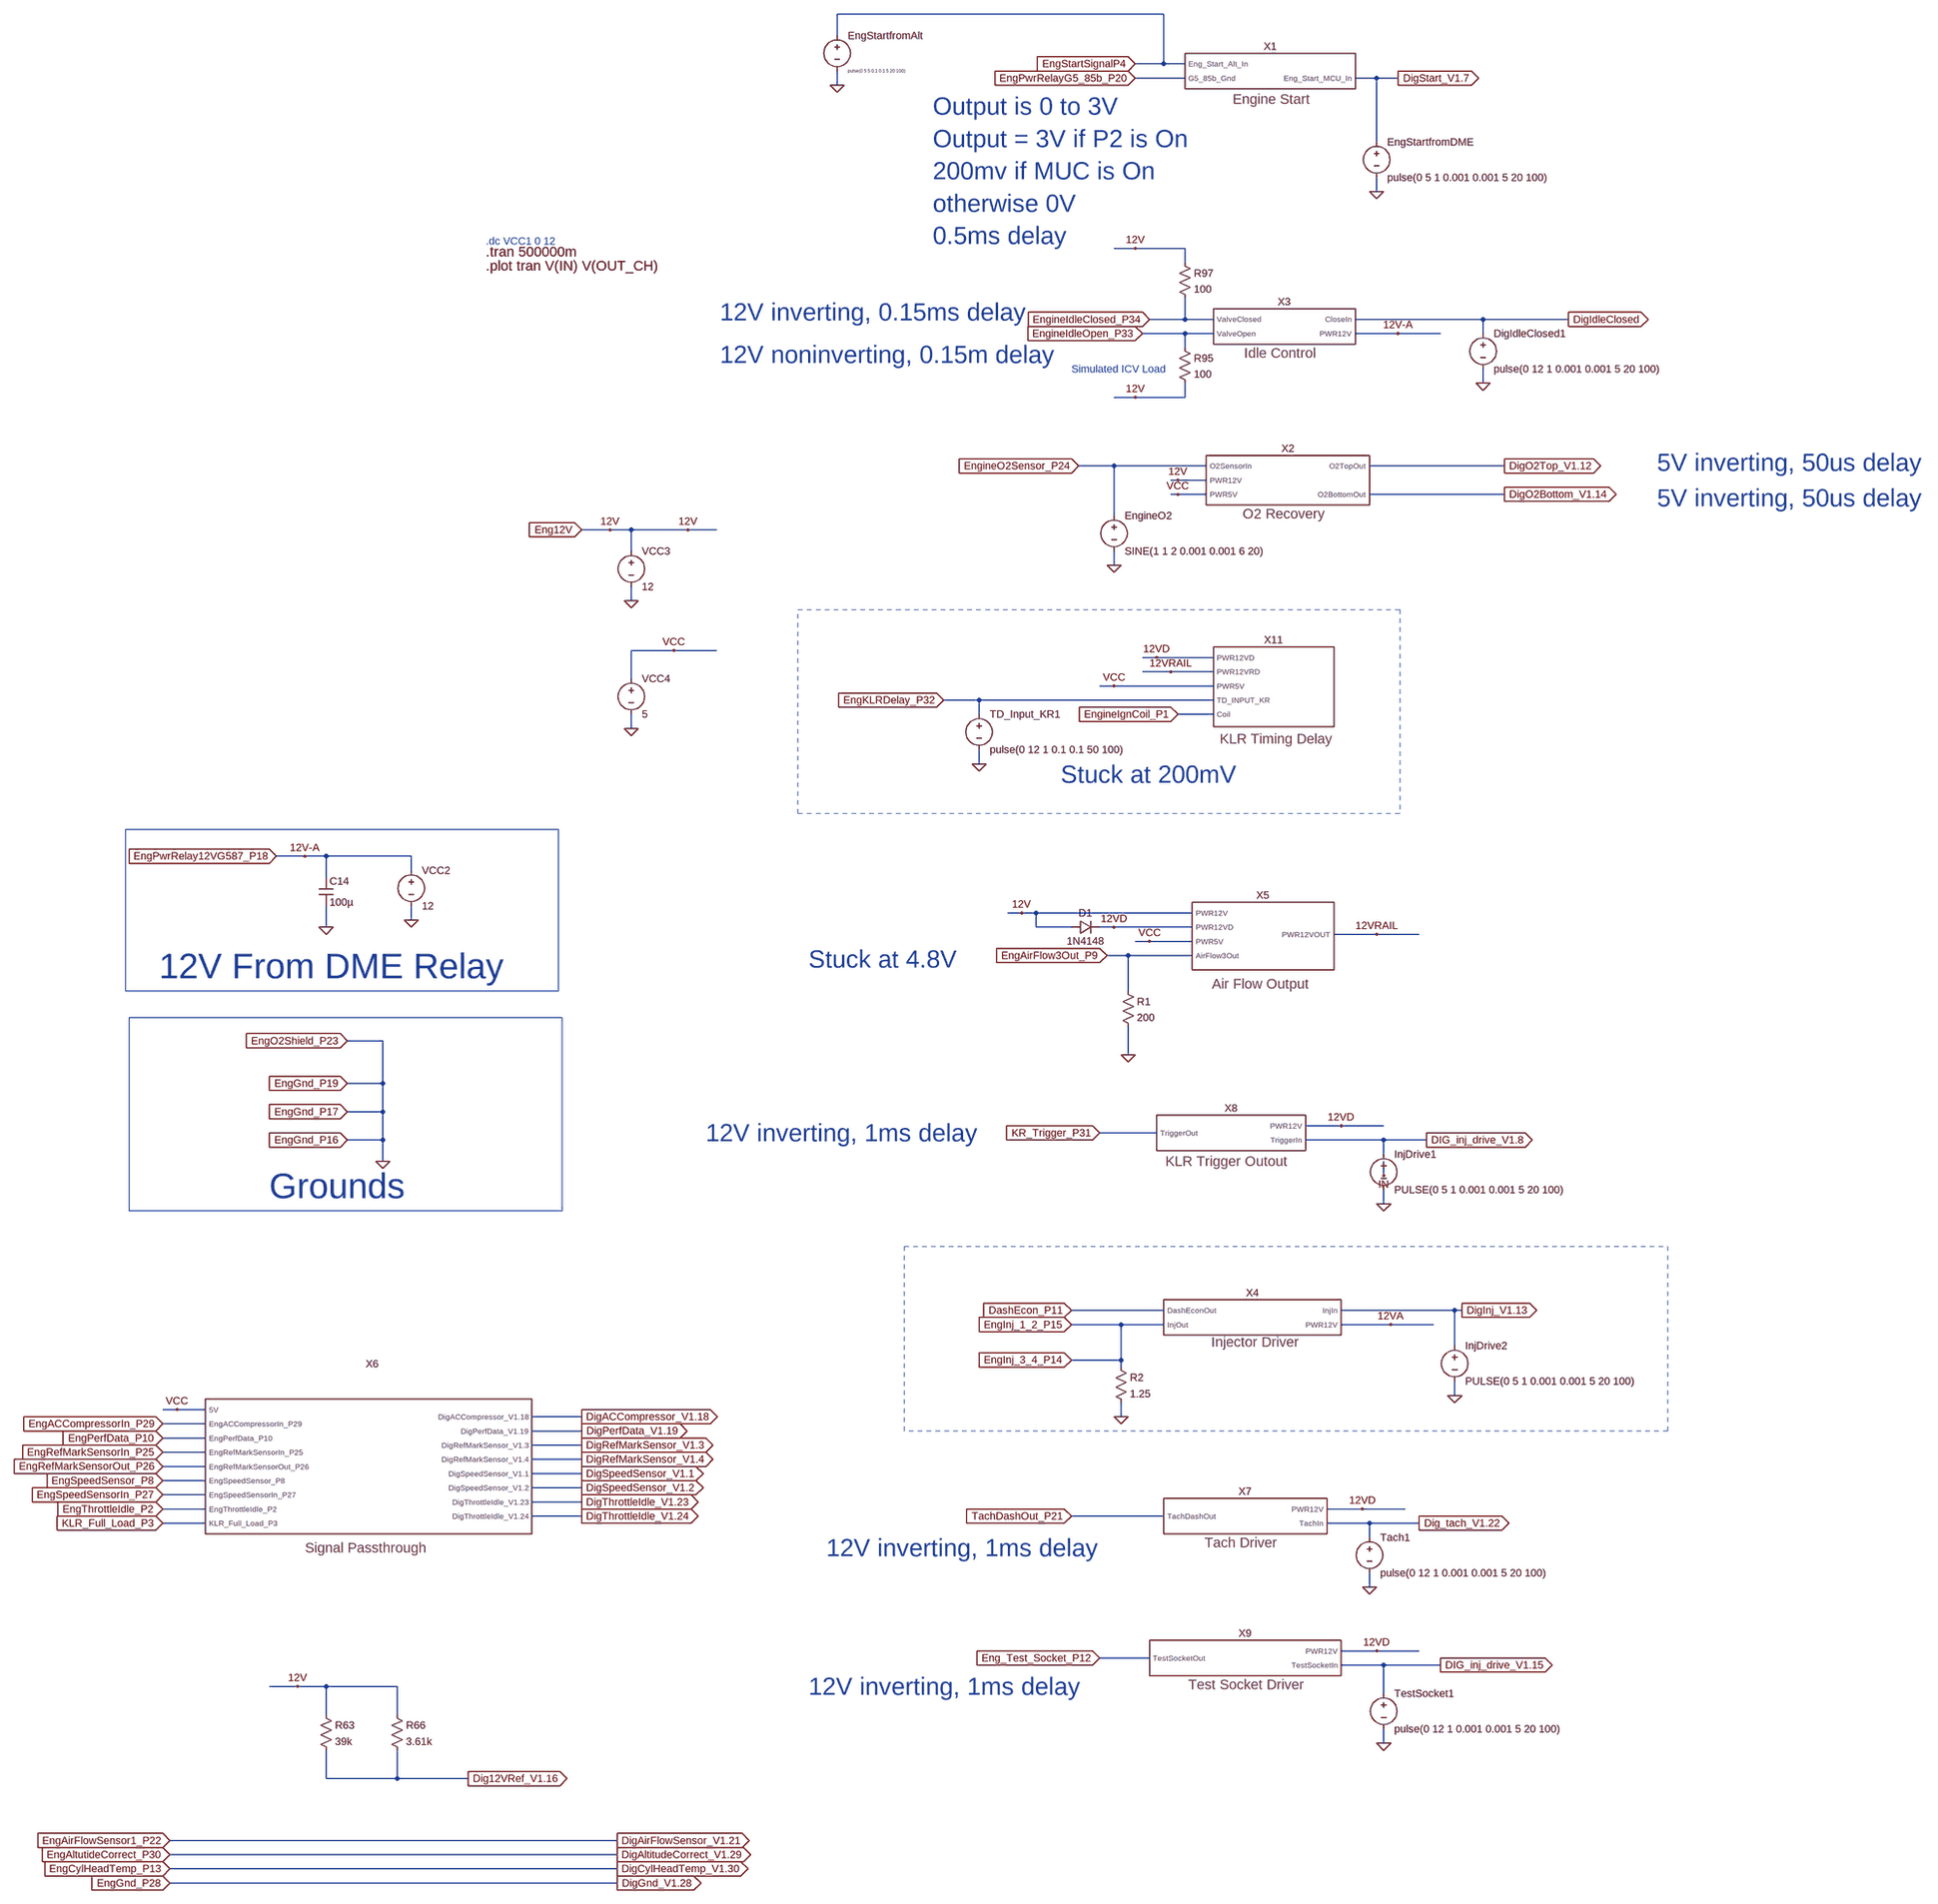
[diagram p0: schematic dme_analog_full_hierchical.asc]
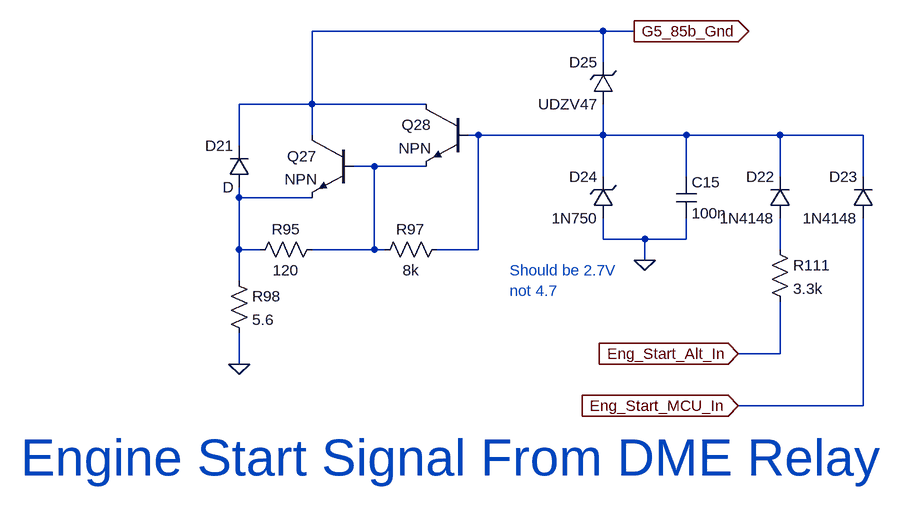
[diagram p1: sub-circuit engine_start.asc]
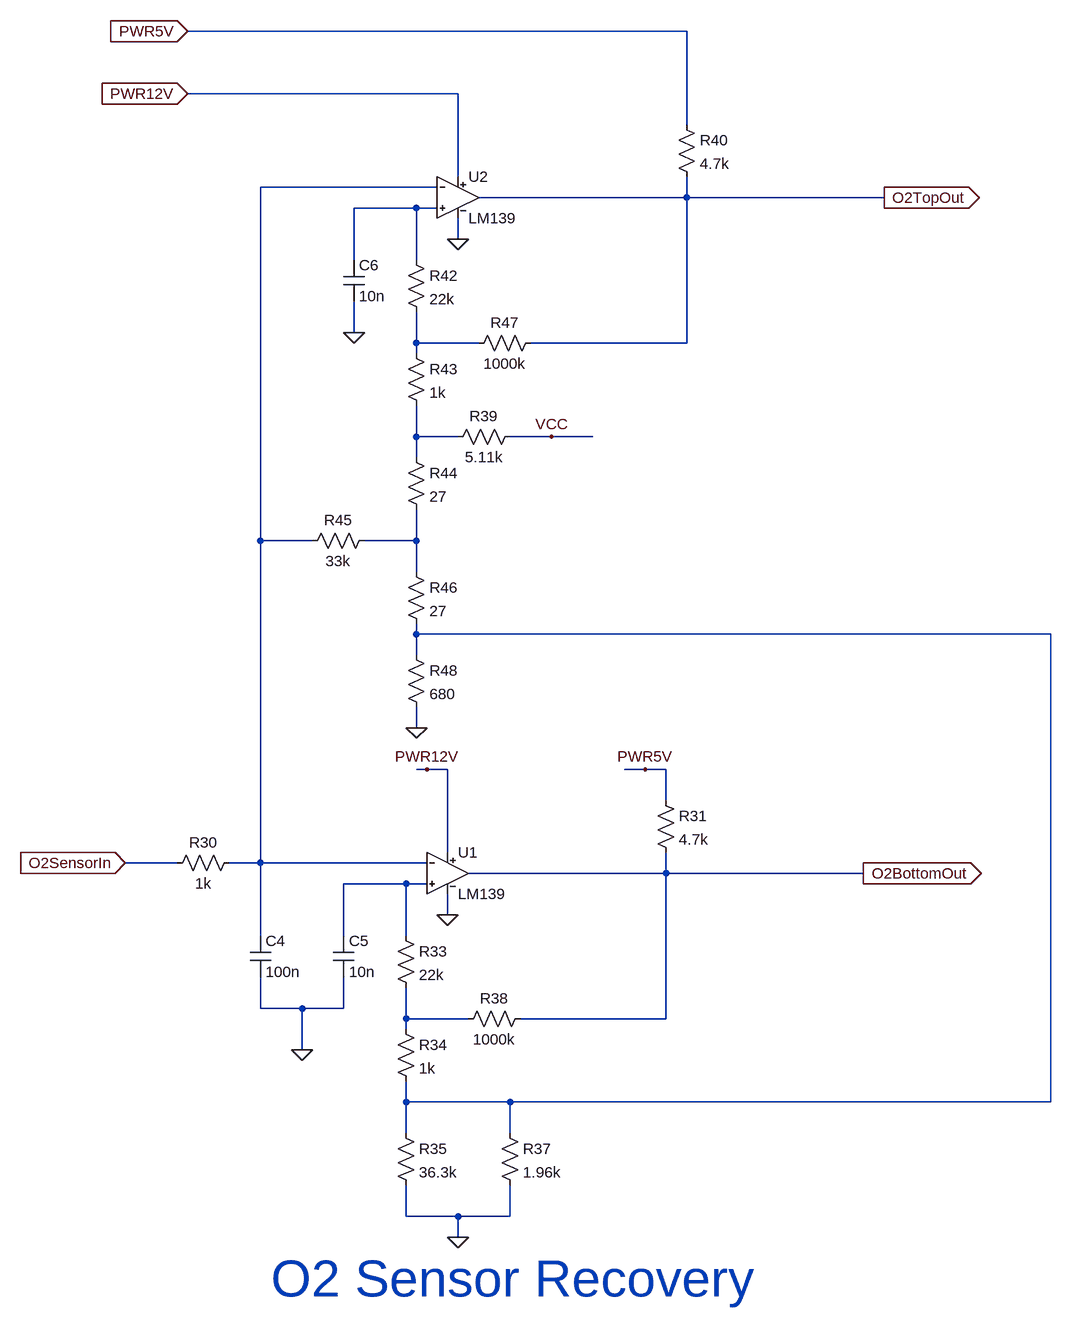
[diagram p2: sub-circuit dme_analog_o2_recovery.asc]
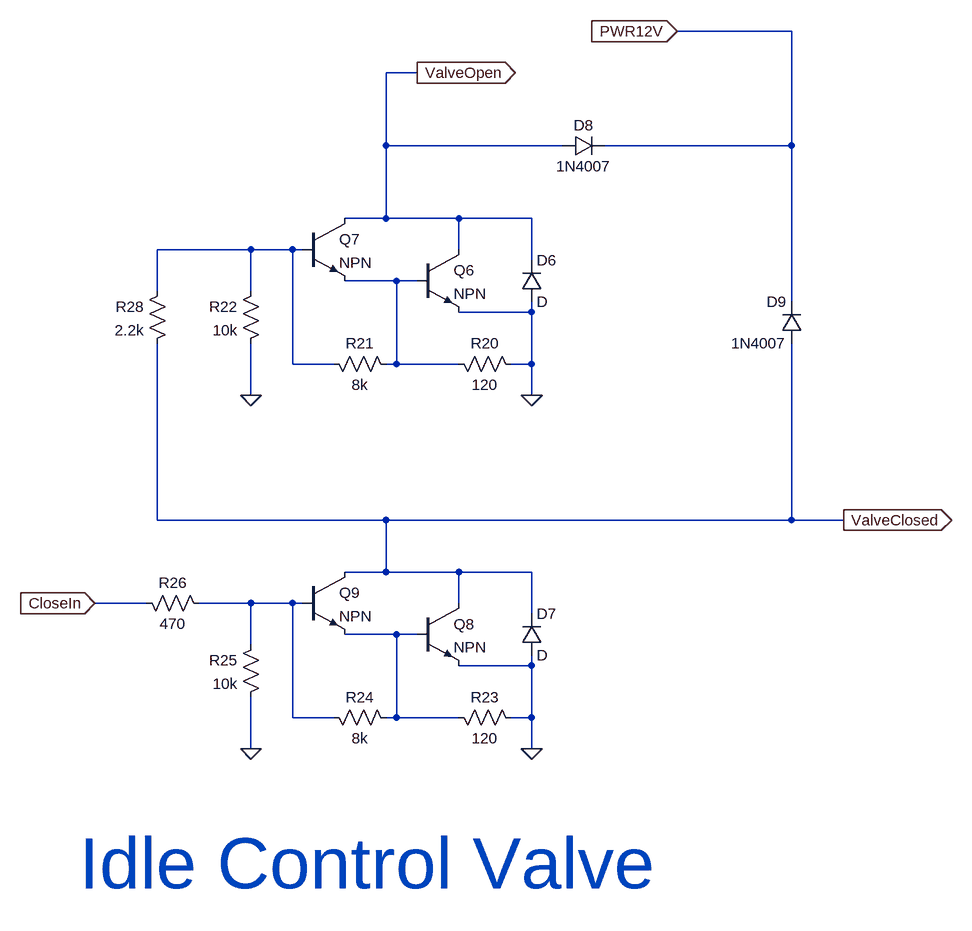
[diagram p3: sub-circuit dme_analog_idle_control.asc]
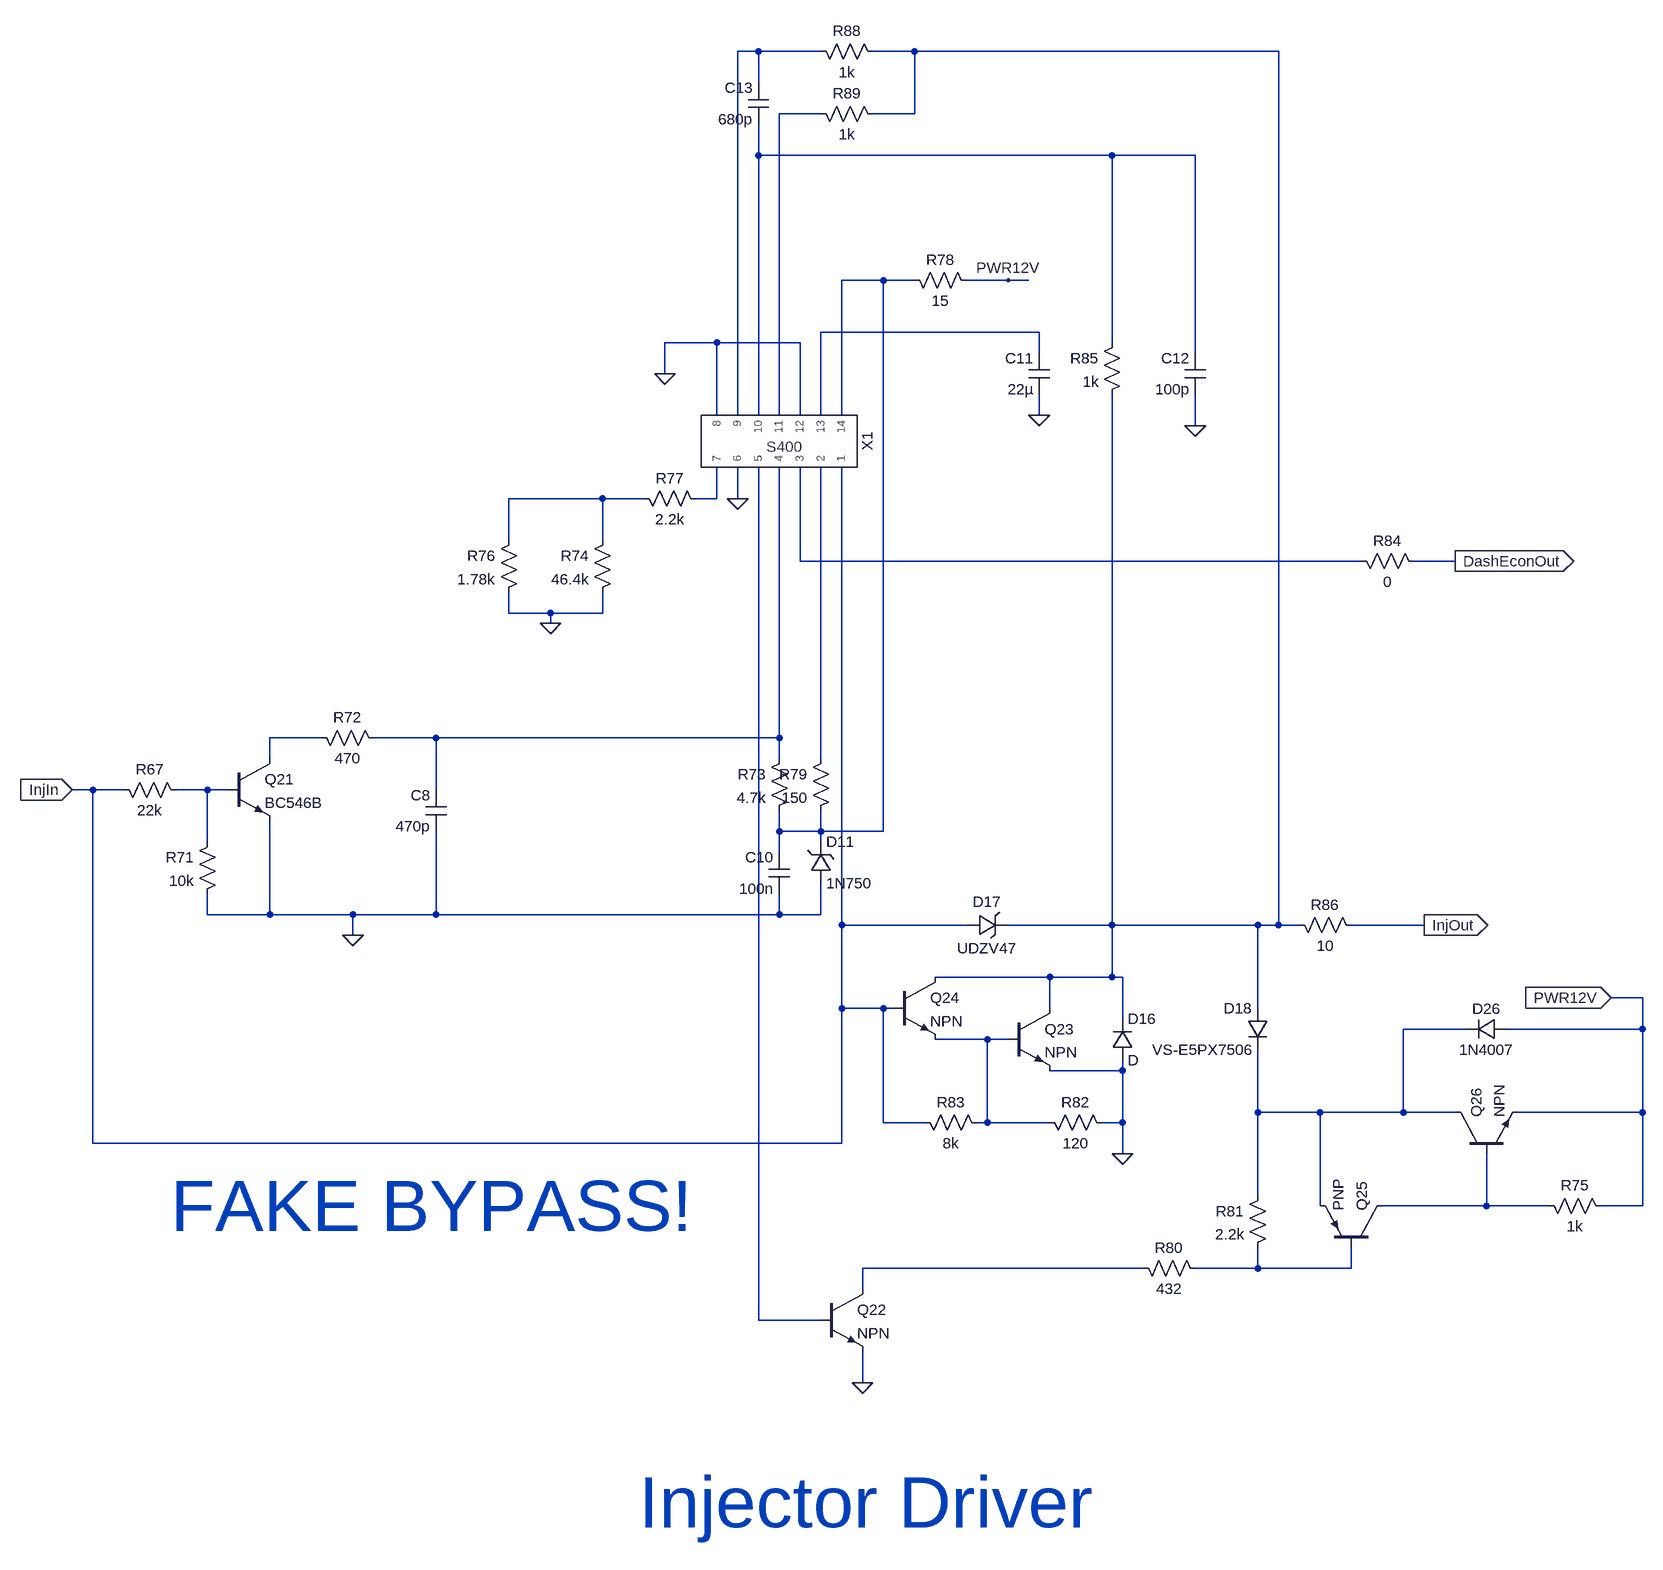
[diagram p4: sub-circuit dme_analog_injector_driver.asc]
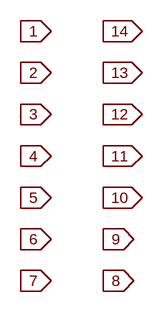
[diagram p5: sub-circuit s400.asc]
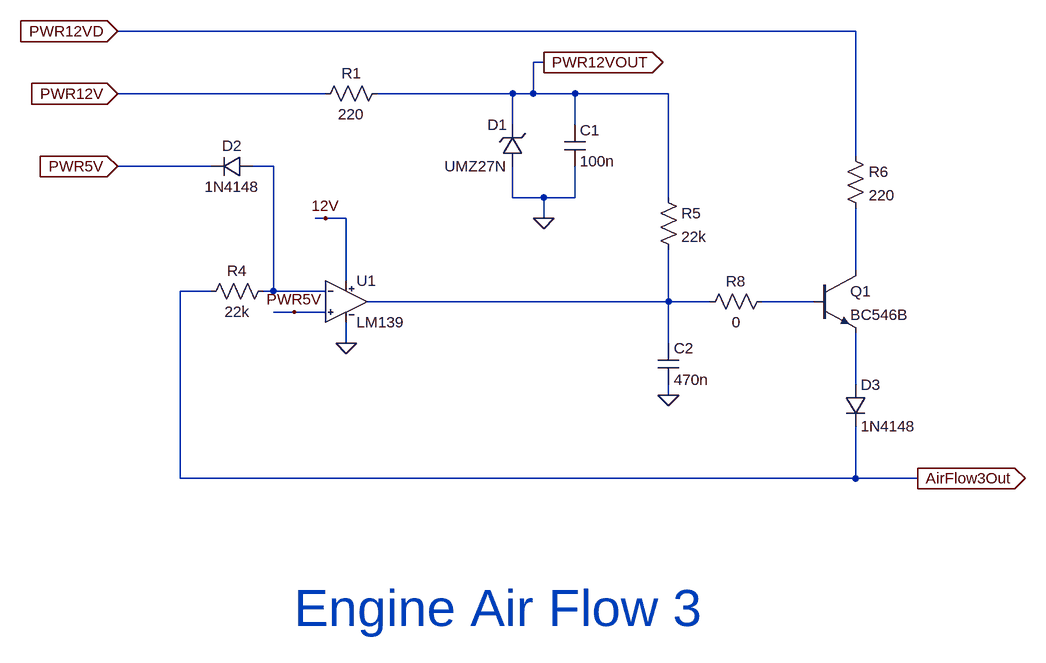
[diagram p6: sub-circuit dme_analog_airflow.asc]
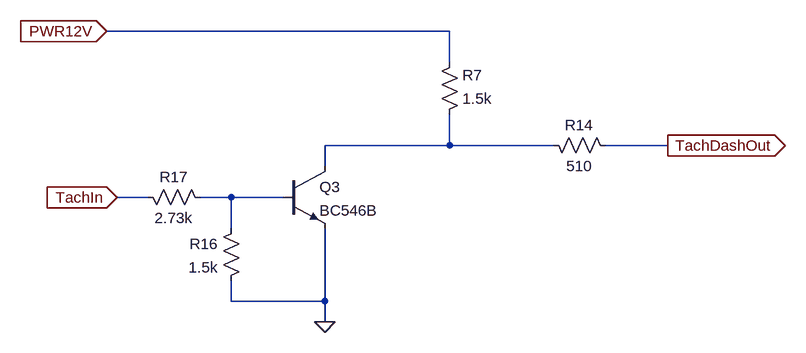
[diagram p7: sub-circuit dme_analog_tach.asc]
dme_analog_full_hierchical.asc, the LTspice schematic file:
Version 4
SHEET 1 4356 7768
WIRE -4000 -4064 -4736 -4064
WIRE -4736 -4016 -4736 -4064
WIRE -4000 -3952 -4000 -4064
WIRE -4000 -3952 -4064 -3952
WIRE -3952 -3952 -4000 -3952
WIRE -3952 -3920 -4064 -3920
WIRE -3520 -3920 -3568 -3920
WIRE -3472 -3920 -3520 -3920
WIRE -4736 -3904 -4736 -3936
WIRE -3520 -3776 -3520 -3920
WIRE -3520 -3664 -3520 -3696
WIRE -4064 -3536 -4112 -3536
WIRE -3952 -3536 -4064 -3536
WIRE -3952 -3504 -3952 -3536
WIRE -3952 -3376 -3952 -3424
WIRE -3952 -3376 -4032 -3376
WIRE -3888 -3376 -3952 -3376
WIRE -3280 -3376 -3568 -3376
WIRE -3088 -3376 -3280 -3376
WIRE -3952 -3344 -4048 -3344
WIRE -3888 -3344 -3952 -3344
WIRE -3472 -3344 -3568 -3344
WIRE -3376 -3344 -3472 -3344
WIRE -3280 -3344 -3280 -3376
WIRE -3952 -3312 -3952 -3344
WIRE -3280 -3232 -3280 -3264
WIRE -4064 -3200 -4112 -3200
WIRE -3952 -3200 -3952 -3232
WIRE -3952 -3200 -4064 -3200
WIRE -4112 -2992 -4192 -2992
WIRE -3904 -2992 -4112 -2992
WIRE -3232 -2992 -3536 -2992
WIRE -3968 -2960 -3984 -2960
WIRE -3904 -2960 -3968 -2960
WIRE -3968 -2928 -3984 -2928
WIRE -3904 -2928 -3968 -2928
WIRE -3232 -2928 -3536 -2928
WIRE -4112 -2880 -4112 -2992
WIRE -5248 -2848 -5312 -2848
WIRE -5200 -2848 -5248 -2848
WIRE -5072 -2848 -5200 -2848
WIRE -5008 -2848 -5072 -2848
WIRE -5200 -2800 -5200 -2848
WIRE -4112 -2768 -4112 -2800
WIRE -5200 -2688 -5200 -2720
WIRE -5104 -2576 -5200 -2576
WIRE -5008 -2576 -5104 -2576
WIRE -4016 -2560 -4048 -2560
WIRE -3888 -2560 -4016 -2560
WIRE -3984 -2528 -4048 -2528
WIRE -3888 -2528 -3984 -2528
WIRE -5200 -2512 -5200 -2576
WIRE -4112 -2496 -4144 -2496
WIRE -3888 -2496 -4112 -2496
WIRE -4416 -2464 -4496 -2464
WIRE -3888 -2464 -4416 -2464
WIRE -4416 -2432 -4416 -2464
WIRE -3888 -2432 -3968 -2432
WIRE -5200 -2400 -5200 -2432
WIRE -4416 -2320 -4416 -2352
WIRE -5936 -2112 -6000 -2112
WIRE -5888 -2112 -5936 -2112
WIRE -5696 -2112 -5888 -2112
WIRE -5696 -2080 -5696 -2112
WIRE -5888 -2064 -5888 -2112
WIRE -4320 -1984 -4352 -1984
WIRE -4288 -1984 -4320 -1984
WIRE -3936 -1984 -4288 -1984
WIRE -5696 -1968 -5696 -2000
WIRE -5888 -1952 -5888 -2000
WIRE -4288 -1952 -4288 -1984
WIRE -4208 -1952 -4288 -1952
WIRE -4112 -1952 -4144 -1952
WIRE -3936 -1952 -4112 -1952
WIRE -3520 -1936 -3616 -1936
WIRE -3424 -1936 -3520 -1936
WIRE -4032 -1920 -4064 -1920
WIRE -3936 -1920 -4032 -1920
WIRE -4080 -1888 -4128 -1888
WIRE -3936 -1888 -4080 -1888
WIRE -4080 -1808 -4080 -1888
WIRE -5760 -1696 -5840 -1696
WIRE -4080 -1664 -4080 -1728
WIRE -5760 -1600 -5760 -1696
WIRE -5760 -1600 -5840 -1600
WIRE -5760 -1536 -5760 -1600
WIRE -5760 -1536 -5840 -1536
WIRE -3600 -1504 -3680 -1504
WIRE -3504 -1504 -3600 -1504
WIRE -4016 -1488 -4144 -1488
WIRE -5760 -1472 -5760 -1536
WIRE -5760 -1472 -5840 -1472
WIRE -3504 -1472 -3680 -1472
WIRE -3408 -1472 -3504 -1472
WIRE -3504 -1440 -3504 -1472
WIRE -5760 -1424 -5760 -1472
WIRE -3504 -1392 -3504 -1424
WIRE -3504 -1328 -3504 -1360
WIRE -4000 -1088 -4208 -1088
WIRE -3344 -1088 -3600 -1088
WIRE -3328 -1088 -3344 -1088
WIRE -4096 -1056 -4208 -1056
WIRE -4000 -1056 -4096 -1056
WIRE -3488 -1056 -3600 -1056
WIRE -3392 -1056 -3488 -1056
WIRE -3344 -1008 -3344 -1088
WIRE -4096 -976 -4096 -1056
WIRE -4096 -976 -4208 -976
WIRE -4096 -960 -4096 -976
WIRE -3344 -896 -3344 -928
WIRE -6224 -864 -6256 -864
WIRE -6160 -864 -6224 -864
WIRE -5312 -848 -5424 -848
WIRE -4096 -848 -4096 -880
WIRE -6160 -832 -6256 -832
WIRE -5312 -816 -5424 -816
WIRE -6160 -800 -6256 -800
WIRE -5312 -784 -5424 -784
WIRE -6160 -768 -6256 -768
WIRE -5312 -752 -5424 -752
WIRE -6160 -736 -6256 -736
WIRE -5312 -720 -5424 -720
WIRE -6160 -704 -6256 -704
WIRE -5312 -688 -5424 -688
WIRE -6160 -672 -6256 -672
WIRE -5312 -656 -5424 -656
WIRE -6160 -640 -6256 -640
WIRE -3552 -640 -3632 -640
WIRE -3456 -640 -3552 -640
WIRE -5312 -624 -5424 -624
WIRE -4000 -624 -4208 -624
WIRE -6160 -608 -6256 -608
WIRE -3536 -608 -3632 -608
WIRE -3424 -608 -3536 -608
WIRE -3536 -576 -3536 -608
WIRE -3536 -464 -3536 -496
WIRE -3520 -320 -3600 -320
WIRE -3424 -320 -3520 -320
WIRE -4032 -304 -4144 -304
WIRE -3504 -288 -3600 -288
WIRE -3376 -288 -3504 -288
WIRE -5952 -240 -6016 -240
WIRE -5888 -240 -5952 -240
WIRE -5728 -240 -5888 -240
WIRE -3504 -224 -3504 -288
WIRE -5888 -176 -5888 -240
WIRE -5728 -176 -5728 -240
WIRE -3504 -112 -3504 -144
WIRE -5888 -32 -5888 -96
WIRE -5728 -32 -5728 -96
WIRE -5728 -32 -5888 -32
WIRE -5568 -32 -5728 -32
WIRE -5232 144 -6240 144
WIRE -5232 176 -6240 176
WIRE -5232 208 -6240 208
WIRE -5232 240 -6240 240
FLAG -5952 -240 12V
FLAG -5568 -32 Dig12VRef_V1.16
IOPIN -5568 -32 Out
FLAG -5840 -1472 EngGnd_P16
IOPIN -5840 -1472 In
FLAG -5840 -1536 EngGnd_P17
IOPIN -5840 -1536 In
FLAG -5840 -1600 EngGnd_P19
IOPIN -5840 -1600 In
FLAG -5840 -1696 EngO2Shield_P23
IOPIN -5840 -1696 In
FLAG -5760 -1424 0
FLAG -6000 -2112 EngPwrRelay12VG587_P18
IOPIN -6000 -2112 In
FLAG -5936 -2112 12V-A
FLAG -5888 -1952 0
FLAG -5312 -2848 Eng12V
IOPIN -5312 -2848 In
FLAG -5248 -2848 12V
FLAG -5696 -1968 0
FLAG -3472 -3920 DigStart_V1.7
IOPIN -3472 -3920 Out
FLAG -4064 -3920 EngPwrRelayG5_85b_P20
IOPIN -4064 -3920 In
FLAG -4064 -3952 EngStartSignalP4
IOPIN -4064 -3952 In
FLAG -4048 -3344 EngineIdleOpen_P33
IOPIN -4048 -3344 In
FLAG -4064 -3200 12V
FLAG -4032 -3376 EngineIdleClosed_P34
IOPIN -4032 -3376 In
FLAG -4064 -3536 12V
FLAG -3088 -3376 DigIdleClosed
IOPIN -3088 -3376 Out
FLAG -3280 -3232 0
FLAG -3472 -3344 12V-A
FLAG -4192 -2992 EngineO2Sensor_P24
IOPIN -4192 -2992 In
FLAG -3968 -2960 12V
FLAG -3968 -2928 VCC
FLAG -3232 -2992 DigO2Top_V1.12
IOPIN -3232 -2992 Out
FLAG -3232 -2928 DigO2Bottom_V1.14
IOPIN -3232 -2928 Out
FLAG -4112 -2768 0
FLAG -5200 -2688 0
FLAG -5200 -2400 0
FLAG -4112 -2496 VCC
FLAG -3968 -2432 EngineIgnCoil_P1
IOPIN -3968 -2432 In
FLAG -4416 -2320 0
FLAG -4496 -2464 EngKLRDelay_P32
IOPIN -4496 -2464 In
FLAG -3984 -2528 12VRAIL
FLAG -4016 -2560 12VD
FLAG -5072 -2848 12V
FLAG -5104 -2576 VCC
FLAG -4032 -1920 VCC
FLAG -4320 -1984 12V
FLAG -4128 -1888 EngAirFlow3Out_P9
IOPIN -4128 -1888 In
FLAG -4080 -1664 0
FLAG -3520 -1936 12VRAIL
FLAG -4112 -1952 12VD
FLAG -4144 -1488 KR_Trigger_P31
IOPIN -4144 -1488 In
FLAG -3424 -608 Dig_tach_V1.22
IOPIN -3424 -608 Out
FLAG -3536 -464 0
FLAG -3408 -1472 DIG_inj_drive_V1.8
IOPIN -3408 -1472 Out
FLAG -3504 -1328 0
FLAG -3504 -1392 IN
FLAG -3600 -1504 12VD
FLAG -3552 -640 12VD
FLAG -4208 -624 TachDashOut_P21
IOPIN -4208 -624 In
FLAG -3488 -1056 12VA
FLAG -3328 -1088 DigInj_V1.13
IOPIN -3328 -1088 Out
FLAG -4208 -1088 DashEcon_P11
IOPIN -4208 -1088 In
FLAG -4208 -1056 EngInj_1_2_P15
IOPIN -4208 -1056 In
FLAG -4208 -976 EngInj_3_4_P14
IOPIN -4208 -976 In
FLAG -3376 -288 DIG_inj_drive_V1.15
IOPIN -3376 -288 Out
FLAG -3504 -112 0
FLAG -4144 -304 Eng_Test_Socket_P12
IOPIN -4144 -304 In
FLAG -3520 -320 12VD
FLAG -5312 -784 DigRefMarkSensor_V1.3
IOPIN -5312 -784 Out
FLAG -5312 -752 DigRefMarkSensor_V1.4
IOPIN -5312 -752 Out
FLAG -5312 -848 DigACCompressor_V1.18
IOPIN -5312 -848 Out
FLAG -5312 -688 DigSpeedSensor_V1.2
IOPIN -5312 -688 Out
FLAG -5312 -816 DigPerfData_V1.19
IOPIN -5312 -816 Out
FLAG -5312 -720 DigSpeedSensor_V1.1
IOPIN -5312 -720 Out
FLAG -5312 -624 DigThrottleIdle_V1.24
IOPIN -5312 -624 Out
FLAG -5312 -656 DigThrottleIdle_V1.23
IOPIN -5312 -656 Out
FLAG -6256 -768 EngRefMarkSensorIn_P25
IOPIN -6256 -768 In
FLAG -6256 -736 EngRefMarkSensorOut_P26
IOPIN -6256 -736 In
FLAG -6256 -832 EngACCompressorIn_P29
IOPIN -6256 -832 In
FLAG -6256 -704 EngSpeedSensor_P8
IOPIN -6256 -704 In
FLAG -6256 -800 EngPerfData_P10
IOPIN -6256 -800 In
FLAG -6256 -672 EngSpeedSensorIn_P27
IOPIN -6256 -672 In
FLAG -6256 -608 KLR_Full_Load_P3
IOPIN -6256 -608 In
FLAG -6256 -640 EngThrottleIdle_P2
IOPIN -6256 -640 In
FLAG -5232 176 DigAltitudeCorrect_V1.29
IOPIN -5232 176 Out
FLAG -5232 144 DigAirFlowSensor_V1.21
IOPIN -5232 144 Out
FLAG -5232 240 DigGnd_V1.28
IOPIN -5232 240 Out
FLAG -5232 208 DigCylHeadTemp_V1.30
IOPIN -5232 208 Out
FLAG -6240 144 EngAirFlowSensor1_P22
IOPIN -6240 144 In
FLAG -6240 240 EngGnd_P28
IOPIN -6240 240 In
FLAG -6240 176 EngAltutideCorrect_P30
IOPIN -6240 176 In
FLAG -6240 208 EngCylHeadTemp_P13
IOPIN -6240 208 In
FLAG -6224 -864 VCC
FLAG -3520 -3664 0
FLAG -4736 -3904 0
FLAG -3344 -896 0
FLAG -4096 -848 0
SYMBOL Res -5904 -192 R0
SYMATTR InstName R63
SYMATTR Value 39k
SYMBOL Res -5744 -192 R0
SYMATTR InstName R66
SYMATTR Value 3.61k
SYMBOL Cap -5904 -2064 R0
SYMATTR InstName C14
SYMATTR Value 100µ
SYMBOL voltage -5696 -2096 R0
SYMATTR InstName VCC2
SYMATTR Value 12
SYMBOL engine_start -3760 -3936 R0
SYMATTR InstName X1
SYMBOL dme_analog_O2_recovery -3728 -2960 R0
SYMATTR InstName X2
SYMBOL dme_analog_idle_control -3728 -3360 M0
SYMATTR InstName X3
SYMBOL dme_analog_injector_driver -3792 -1072 M0
SYMATTR InstName X4
SYMBOL dme_analog_airflow -3776 -1952 R0
SYMATTR InstName X5
SYMBOL dme_analog_tach -3808 -624 M0
SYMATTR InstName X7
SYMBOL dme_analog_KLR_Trigger -3840 -1488 M0
SYMATTR InstName X8
SYMBOL dme_analog_test_socket -3808 -304 M0
SYMATTR InstName X9
SYMBOL Res -3968 -3328 R0
SYMATTR InstName R95
SYMATTR Value 100
SYMBOL Res -3968 -3520 R0
SYMATTR InstName R97
SYMATTR Value 100
SYMBOL voltage -3280 -3360 R0
SYMATTR Value pulse(0 12 1 0.001 0.001 5 20 100)
SYMATTR InstName DigIdleClosed1
SYMBOL voltage -4112 -2896 R0
SYMATTR Value SINE(1 1 2 0.001 0.001 6 20)
SYMATTR InstName EngineO2
SYMBOL dme_analog_timing_delay -3760 -2512 R0
SYMATTR InstName X11
SYMBOL voltage -5200 -2816 R0
SYMATTR InstName VCC3
SYMATTR Value 12
SYMBOL voltage -5200 -2528 R0
SYMATTR InstName VCC4
SYMATTR Value 5
SYMBOL voltage -4416 -2448 R0
SYMATTR Value pulse(0 12 1 0.1 0.1 50 100)
SYMATTR InstName TD_Input_KR1
SYMBOL Res -4096 -1824 R0
SYMATTR InstName R1
SYMATTR Value 200
SYMBOL diode -4208 -1968 M90
WINDOW 0 0 32 VBottom 2
WINDOW 3 32 32 VTop 2
SYMATTR InstName D1
SYMATTR Value 1N4148
SYMBOL voltage -3536 -592 R0
SYMATTR Value pulse(0 12 1 0.001 0.001 5 20 100)
SYMATTR InstName Tach1
SYMBOL voltage -3504 -1456 R0
SYMATTR Value PULSE(0 5 1 0.001 0.001 5 20 100)
SYMATTR InstName InjDrive1
SYMBOL voltage -3504 -240 R0
SYMATTR Value pulse(0 12 1 0.001 0.001 5 20 100)
SYMATTR InstName TestSocket1
SYMBOL dme_analog_passthrough -5792 -736 R0
WINDOW 0 8 -216 Bottom 2
SYMATTR InstName X6
SYMBOL voltage -3520 -3792 R0
SYMATTR Value pulse(0 5 1 0.001 0.001 5 20 100)
SYMATTR InstName EngStartfromDME
SYMBOL voltage -4736 -4032 R0
WINDOW 3 24 96 Left 0
SYMATTR Value pulse(0 5 5 0.1 0.1 5 20 100)
SYMATTR InstName EngStartfromAlt
SYMBOL voltage -3344 -1024 R0
SYMATTR Value PULSE(0 5 1 0.001 0.001 5 20 100)
SYMATTR InstName InjDrive2
SYMBOL Res -4112 -976 R0
SYMATTR InstName R2
SYMATTR Value 1.25
TEXT -6264 -1864 Left 6 ;12V From DME Relay
TEXT -6016 -1368 Left 6 ;Grounds
TEXT -4208 -3264 Left 2 ;Simulated ICV Load
TEXT -2888 -3000 Left 5 ;5V inverting, 50us delay
TEXT -4520 -3856 Left 5 ;Output is 0 to 3V\nOutput = 3V if P2 is On\n200mv if MUC is On\notherwise 0V\n0.5ms delay
TEXT -5000 -3392 Left 5 ;12V inverting, 0.15ms delay
TEXT -4800 -1880 Left 5 ;Stuck at 4.8V
TEXT -5032 -1488 Left 5 ;12V inverting, 1ms delay
TEXT -4800 -240 Left 5 ;12V inverting, 1ms delay
TEXT -4760 -552 Left 5 ;12V inverting, 1ms delay
TEXT -4232 -2296 Left 5 ;Stuck at 200mV
TEXT -5528 -3528 Left 3 !.tran 500000m
TEXT -5528 -3496 Left 3 !.plot tran V(IN) V(OUT_CH)
TEXT -5528 -3552 Left 2 ;.dc VCC1 0 12
TEXT -2888 -2920 Left 5 ;5V inverting, 50us delay
TEXT -5000 -3296 Left 5 ;12V noninverting, 0.15m delay
RECTANGLE Normal -6340 -2172 -5364 -1808
RECTANGLE Normal -6332 -1748 -5356 -1312
RECTANGLE Normal -4584 -1232 -2864 -816 2
RECTANGLE Normal -4824 -2668 -3468 -2208 2

The netlist it stands for:
* dme_analog_full_hierchical.asc
R63 Eng12V Dig12VRef_V1.16 39k
R66 Eng12V Dig12VRef_V1.16 3.61k
C14 12V-A 0 100µ
VCC2 12V-A 0 12
XX1 EngStartSignalP4 DigStart_V1.7 EngPwrRelayG5_85b_P20 engine_start
XX2 EngineO2Sensor_P24 Eng12V VCC DigO2Bottom_V1.14 DigO2Top_V1.12 dme_analog_o2_recovery
XX3 DigIdleClosed 12V-A EngineIdleClosed_P34 EngineIdleOpen_P33 dme_analog_idle_control
XX4 DigInj_V1.13 12VA DashEcon_P11 EngInj_3_4_P14 dme_analog_injector_driver
XX5 Eng12V 12VD VCC EngAirFlow3Out_P9 12VRAIL dme_analog_airflow
XX7 12VD Dig_tach_V1.22 TachDashOut_P21 dme_analog_tach
XX8 12VD DIG_inj_drive_V1.8 KR_Trigger_P31 dme_analog_klr_trigger
XX9 12VD DIG_inj_drive_V1.15 Eng_Test_Socket_P12 dme_analog_test_socket
R95 EngineIdleOpen_P33 Eng12V 100
R97 Eng12V EngineIdleClosed_P34 100
V§DigIdleClosed1 DigIdleClosed 0 pulse(0 12 1 0.001 0.001 5 20 100)
V§EngineO2 EngineO2Sensor_P24 0 SINE(1 1 2 0.001 0.001 6 20)
XX11 12VD 12VRAIL VCC EngKLRDelay_P32 EngineIgnCoil_P1 dme_analog_timing_delay
VCC3 Eng12V 0 12
VCC4 VCC 0 5
V§TD_Input_KR1 EngKLRDelay_P32 0 pulse(0 12 1 0.1 0.1 50 100)
R1 EngAirFlow3Out_P9 0 200
D1 Eng12V 12VD 1N4148
V§Tach1 Dig_tach_V1.22 0 pulse(0 12 1 0.001 0.001 5 20 100)
V§InjDrive1 DIG_inj_drive_V1.8 0 PULSE(0 5 1 0.001 0.001 5 20 100)
V§TestSocket1 DIG_inj_drive_V1.15 0 pulse(0 12 1 0.001 0.001 5 20 100)
XX6 VCC EngACCompressorIn_P29 EngPerfData_P10 EngRefMarkSensorIn_P25 EngRefMarkSensorOut_P26 EngSpeedSensor_P8 EngSpeedSensorIn_P27 EngThrottleIdle_P2 KLR_Full_Load_P3 DigACCompressor_V1.18 DigPerfData_V1.19 DigRefMarkSensor_V1.3 DigRefMarkSensor_V1.4 DigSpeedSensor_V1.1 DigSpeedSensor_V1.2 DigThrottleIdle_V1.23 DigThrottleIdle_V1.24 dme_analog_passthrough
V§EngStartfromDME DigStart_V1.7 0 pulse(0 5 1 0.001 0.001 5 20 100)
V§EngStartfromAlt EngStartSignalP4 0 pulse(0 5 5 0.1 0.1 5 20 100)
V§InjDrive2 DigInj_V1.13 0 PULSE(0 5 1 0.001 0.001 5 20 100)
R2 EngInj_3_4_P14 0 1.25

* block symbol definitions
.subckt engine_start Eng_Start_Alt_In Eng_Start_MCU_In G5_85b_Gnd
Q27 G5_85b_Gnd N002 N003 0 NPN
Q28 G5_85b_Gnd N001 N002 0 NPN
D21 N003 G5_85b_Gnd D
R95 N002 N003 120
R97 N002 N001 8k
R98 N003 0 5.6
D22 N004 N001 1N4148
D23 Eng_Start_MCU_In N001 1N4148
R111 N004 Eng_Start_Alt_In 3.3k
C15 N001 0 100n
D24 0 N001 1N750
D25 N001 G5_85b_Gnd UDZV47
* Engine Start Signal From DME Relay
* Should be 2.7V
* not 4.7
.ends engine_start

.subckt dme_analog_o2_recovery O2SensorIn PWR12V PWR5V O2BottomOut O2TopOut
R30 N001 O2SensorIn 1k
R31 PWR5V O2BottomOut 4.7k
C4 N001 0 100n
C5 N007 0 10n
R33 N007 N008 22k
R34 N008 N006 1k
R35 N006 0 36.3k
R37 N006 0 1.96k
R38 O2BottomOut N008 1000k
R40 PWR5V O2TopOut 4.7k
C6 N002 0 10n
R42 N002 N003 22k
R43 N003 N004 1k
R44 N004 N005 27
R47 O2TopOut N003 1000k
R39 VCC N004 5.11k
R45 N005 N001 33k
R46 N005 N006 27
R48 N006 0 680
XU1 N007 N001 PWR12V 0 O2BottomOut LM139  ; pins In+ In- V+ V- OUT
XU2 N002 N001 PWR12V 0 O2TopOut LM139  ; pins In+ In- V+ V- OUT
* O2 Sensor Recovery
.ends dme_analog_o2_recovery

.subckt dme_analog_idle_control CloseIn PWR12V ValveClosed ValveOpen
Q6 ValveOpen N002 0 0 NPN
Q7 ValveOpen N001 N002 0 NPN
D6 0 ValveOpen D
R20 N002 0 120
R21 N002 N001 8k
R22 N001 0 10k
Q8 ValveClosed N004 0 0 NPN
Q9 ValveClosed N003 N004 0 NPN
D7 0 ValveClosed D
R23 N004 0 120
R24 N004 N003 8k
R25 N003 0 10k
R26 CloseIn N003 470
D8 ValveOpen PWR12V 1N4007
R28 N001 ValveClosed 2.2k
D9 ValveClosed PWR12V 1N4007
* Idle Control Valve
.ends dme_analog_idle_control

.subckt dme_analog_injector_driver InjIn PWR12V DashEconOut InjOut
R67 InjIn N013 22k
R71 N013 0 10k
R72 N010 N011 470
C8 N011 0 470p
Q21 N010 N013 0 0 BC546B
R73 N011 N005 4.7k
C10 N005 0 100n
R74 N007 0 46.4k
R76 N007 0 1.78k
R77 N007 N008 2.2k
R79 N012 N005 150
D11 0 N005 1N750
R78 N005 PWR12V 15
Q22 N017 N019 0 0 NPN
R80 N017 N018 432
R81 N014 N018 2.2k
Q23 N002 N015 0 0 NPN
Q24 N002 InjIn N015 0 NPN
D16 0 N002 D
R82 N015 0 120
R83 N015 InjIn 8k
R84 N009 DashEconOut 0
C11 N006 0 22µ
R85 N004 N002 1k
D17 InjIn N002 UDZV47
R86 N002 InjOut 10
C12 N004 0 100p
Q25 N016 N018 N014 0 PNP
Q26 N014 N016 PWR12V 0 NPN
D18 N002 N014 VS-E5PX7506
R89 N003 N002 1k
R88 N001 N002 1k
C13 N001 N004 680p
D26 PWR12V N014 1N4007
R75 N016 PWR12V 1k
XX1 InjIn N012 N009 N011 N019 0 N008 N005 N006 0 N003 N004 N001 0 s400
* Injector Driver
* FAKE BYPASS!
.ends dme_analog_injector_driver

.subckt s400 1 2 3 4 5 6 7 14 13 12 11 10 9 8
.ends s400

.subckt dme_analog_airflow PWR12V PWR12VD PWR5V AirFlow3Out PWR12VOUT
R4 N001 AirFlow3Out 22k
D2 N001 PWR5V 1N4148
R5 PWR12VOUT N003 22k
C2 N003 0 470n
D3 N005 AirFlow3Out 1N4148
Q1 N002 N004 N005 0 BC546B
R6 PWR12VD N002 220
R8 N004 N003 0
D1 0 PWR12VOUT UMZ27N
C1 PWR12VOUT 0 100n
R1 PWR12VOUT PWR12V 220
XU1 PWR5V N001 12V 0 N003 LM139  ; pins In+ In- V+ V- OUT
* Engine Air Flow 3
.ends dme_analog_airflow

.subckt dme_analog_tach PWR12V TachIn TachDashOut
R7 N001 PWR12V 1.5k
Q3 N001 N002 0 0 BC546B
R16 N002 0 1.5k
R17 TachIn N002 2.73k
R14 N001 TachDashOut 510
.ends dme_analog_tach

.subckt dme_analog_klr_trigger PWR12V TriggerIn TriggerOut
Q2 N001 N002 N003 0 BC546B
R9 PWR12V N001 1.5k
R10 N003 0 0
R11 N002 0 3.3k
R13 TriggerIn N002 220
R12 N001 TriggerOut 510
* KL_Trigger_Drive
.ends dme_analog_klr_trigger

.subckt dme_analog_test_socket PWR12V TestSocketIn TestSocketOut
Q18 N001 N002 0 0 BC546B
R60 PWR12V N001 1.5k
R68 N002 0 2.2k
R69 TestSocketIn N002 2.2k
R70 N001 TestSocketOut 510
* Test Socket
.ends dme_analog_test_socket

.subckt dme_analog_timing_delay PWR12VD PWR12VRD PWR5V TD_INPUT_KR Coil
R501 PWR12VRD TD_INPUT_KR 10k
R502 N004 N008 1k
C501 N008 TD_INPUT_KR 470n
D501 N004 PWR12VRD 1N4148
R513 N003 PWR12VRD 22k
R512 N003 N006 220k
R511 N006 0 13.1k
D502 OUT_CH N003 1N4148
R506 PWR5V OUT_CH 1k
R1 PWR12VRD N006 100k
R2 PWR12VRD N004 330k
Q10 OUT_CH N002 N007 0 NPN
Q11 N005 N001 N007 0 NPN
R32 N007 0 287
R36 PWR5V N002 5.62k
R41 PWR5V N001 5.62k
R49 PWR5V N005 1k
R50 N001 0 3.83k
R51 N001 0 121k
R52 N001 0 14.7k
Q12 Coil N013 N014 0 NPN
Q13 Coil N012 N013 0 NPN
D10 N014 Coil D
R53 N013 N014 120
R54 N013 N012 8k
R55 N013 0 1
R56 N013 0 18
R57 N012 N013 100
R59 N013 N002 2.2k
R58 N012 N011 15
C3 N013 0 10n
D12 0 Coil 1N4007
C7 Coil 0 10n
R61 N009 Coil 1.8k
R62 N009 0 5.62k
R64 N009 0 8.25k
C9 N009 Coil 330p
D13 N010 N009 1N4148
D14 N012 N010 1N4148
Q14 N011 N015 PWR12VD 0 PNP
Q15 N015 OUT_CH N011 0 BC546B
R65 N015 PWR12VD 150
XU1 N006 N004 PWR12VRD 0 N003 LM139  ; pins In+ In- V+ V- OUT
* TIMING DELAY FROM KLR
.ends dme_analog_timing_delay

.subckt dme_analog_passthrough 5V EngACCompressorIn_P29 EngPerfData_P10 EngRefMarkSensorIn_P25 EngRefMarkSensorOut_P26 EngSpeedSensor_P8 EngSpeedSensorIn_P27 EngThrottleIdle_P2 KLR_Full_Load_P3 DigACCompressor_V1.18 DigPerfData_V1.19 DigRefMarkSensor_V1.3 DigRefMarkSensor_V1.4 DigSpeedSensor_V1.1 DigSpeedSensor_V1.2 DigThrottleIdle_V1.23 DigThrottleIdle_V1.24
R87 5V KLR_Full_Load_P3 47k
R90 5V DigThrottleIdle_V1.24 15.3k
D19 DigThrottleIdle_V1.24 KLR_Full_Load_P3 D
R91 5V EngThrottleIdle_P2 47k
R92 5V DigThrottleIdle_V1.23 15.3k
D20 DigThrottleIdle_V1.23 EngThrottleIdle_P2 D
R93 DigSpeedSensor_V1.2 EngSpeedSensor_P8 33k
R94 DigPerfData_V1.19 EngPerfData_P10 33k
R96 DigPerfData_V1.19 5V 2.2k
R99 DigRefMarkSensor_V1.3 EngRefMarkSensorIn_P25 55.2k
R100 DigRefMarkSensor_V1.4 EngRefMarkSensorOut_P26 55.2k
R101 DigSpeedSensor_V1.1 EngSpeedSensorIn_P27 33k
R102 DigACCompressor_V1.18 EngACCompressorIn_P29 100k
* Passthroughs to Digital
.ends dme_analog_passthrough

.model D D
.lib standard.dio
.model NPN NPN
.model PNP PNP
.lib standard.bjt
* 12V From DME Relay
* Grounds
* Simulated ICV Load
* 5V inverting, 50us delay
* Output is 0 to 3V
* Output = 3V if P2 is On
* 200mv if MUC is On
* otherwise 0V
* 0.5ms delay
* 12V inverting, 0.15ms delay
* Stuck at 4.8V
* 12V inverting, 1ms delay
* 12V inverting, 1ms delay
* 12V inverting, 1ms delay
* Stuck at 200mV
.tran 500000m
.plot tran V(IN) V(OUT_CH)
* .dc VCC1 0 12
* 5V inverting, 50us delay
* 12V noninverting, 0.15m delay
.lib lm139.cir
.backanno
.end